# EasyEDA Pro project ProPrj_red-panda-afm_2025-05-21.epro, board PCB2
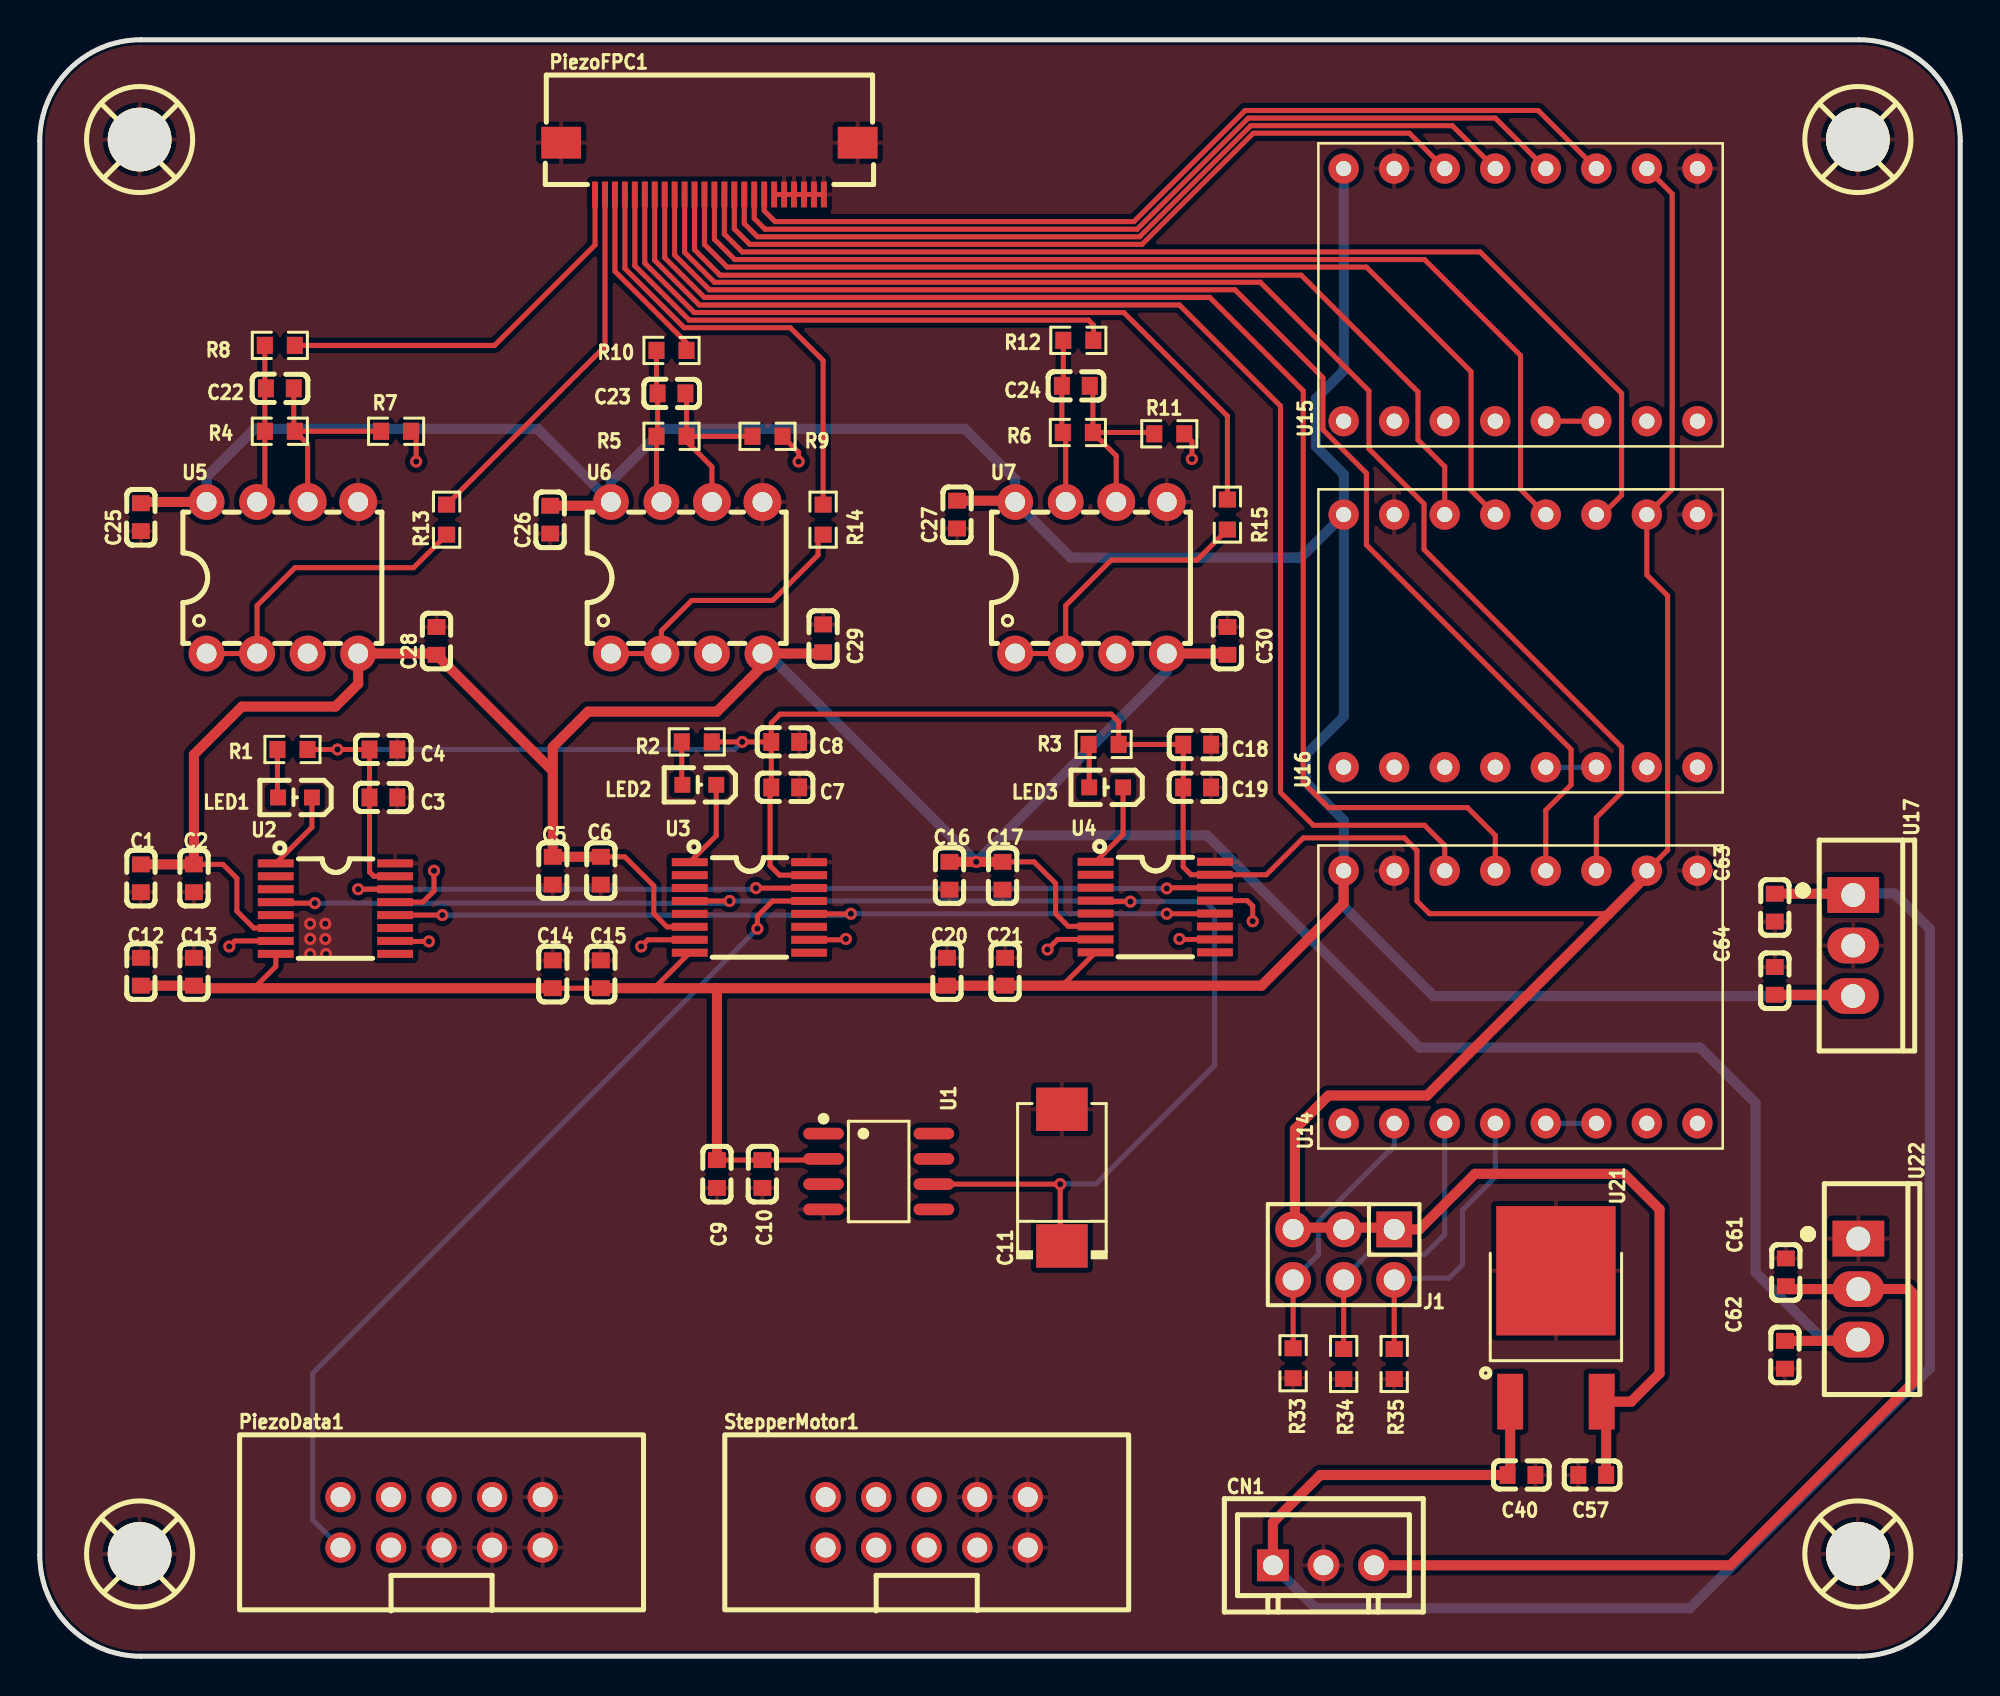
[diagram p8: board, top side]
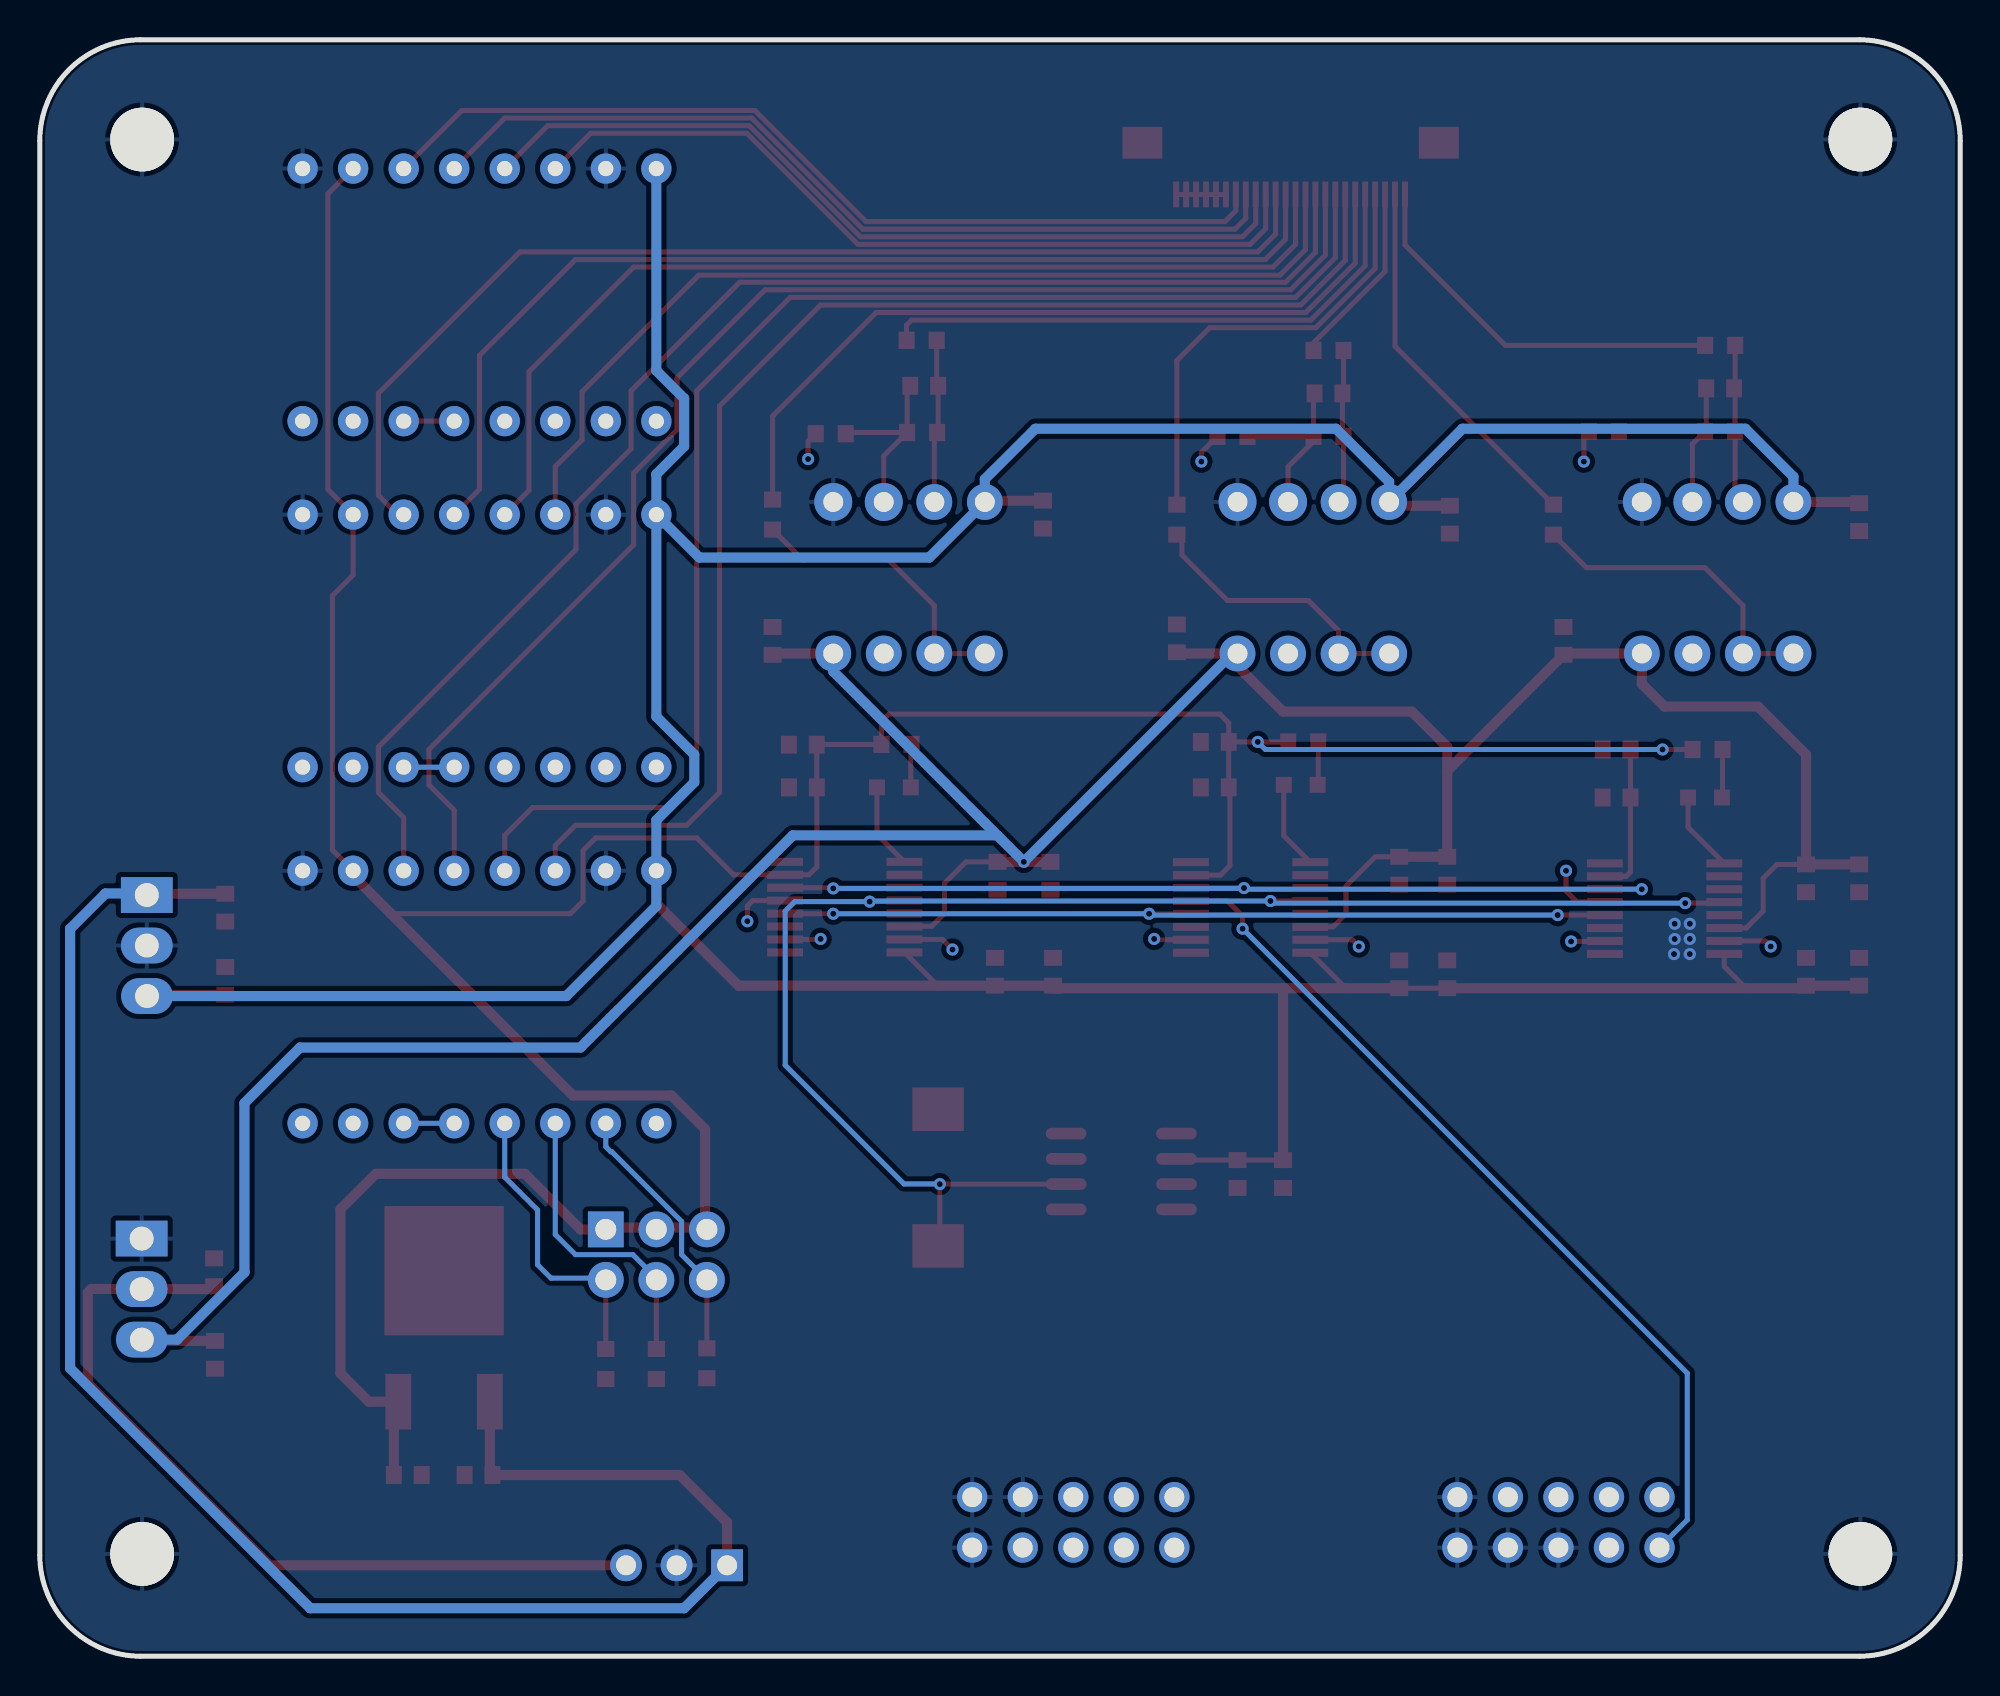
[diagram p9: board, bottom side, seen from below]

Outline 96.52 x 81.28 mm; copper layers: Top Layer, Inner1, Inner2, Bottom Layer. Coordinates in mm from the lower left corner of the outline.
Outline path: 0,76.2 0,5.08 arc(1.49,1.49) 5.08,0 91.44,0 arc(95.03,1.49) 96.52,5.08 96.52,76.2 arc(95.03,79.79) 91.44,81.28 5.08,81.28 arc(1.49,79.79) 0,76.2
Stack: Top Layer 0.035mm Outer layer copper thickness 1oz / Dielectric1 0.2104mm 7628 RC49% 8.6mil / Inner1 0.0152mm Inner layer copper thickness / Dielectric2 1.065mm 1.1mm H/HOZ Copper / Inner2 0.0152mm Inner layer copper thickness / Dielectric3 0.2104mm 7628 RC49% 8.6mil / Bottom Layer 0.035mm Outer layer copper thickness 1oz

## Design rules (mm)
template: JLCPCB Capability(Two Layers Board)
spacing copperThickness1oz (default): track to track 0.102, other pairs 0.152 to 0.3
spacing copperThickness2oz: track to track 0.203, other pairs 0.152 to 0.3
track width copperThickness1oz (default): min 0.127, default 0.254, max 2.54
track width copperThickness2oz: min 0.203, default 0.254, max 2.54
differential pair differentialPair (default): width min 0.127, default 0.254, max 2.54; gap min 0.152, default 0.152
via viaSize (default): diameter min 0.5, default 0.61, max 10; hole min 0.3, default 0.305, max 6.3

## Placement (name value [footprint] x y rotation side)
C1  10uF  [C0603]  5.08 39.12 270 top
C2  100nF  [C0603]  7.75 39.12 270 top
C3  10uF  [C0603]  17.27 43.18 0 top
C4  100nF  [C0603]  17.27 45.59 0 top
C5  10uF  [C0603]  25.78 39.5 270 top
C6  100nF  [C0603]  28.19 39.5 270 top
C7  10uF  [C0603]  37.47 43.69 0 top
C8  100nF  [C0603]  37.47 45.97 0 top
C9  10uF  [C0603]  34.03 24.25 90 top
C10  100nF  [C0603]  36.32 24.25 90 top
C11  100uF  [CAP-SMD_L7.3-W4.3-FD]  51.37 24.07 90 top
C12  10uF  [C0603]  5.08 34.42 270 top
C13  100nF  [C0603]  7.75 34.42 270 top
C14  10uF  [C0603]  25.78 34.29 270 top
C15  100nF  [C0603]  28.19 34.29 270 top
C16  10uF  [C0603]  45.72 39.24 270 top
C17  100nF  [C0603]  48.39 39.24 270 top
C18  10uF  [C0603]  58.17 45.84 0 top
C19  100nF  [C0603]  58.17 43.69 0 top
C20  10uF  [C0603]  45.59 34.42 270 top
C21  100nF  [C0603]  48.51 34.42 270 top
C22  4.7nF  [C0603]  12.06 63.75 180 top
C23  4.7nF  [C0603]  31.75 63.5 180 top
C24  4.7nF  [C0603]  52.07 63.88 180 top
C25  100nF  [C0603]  5.08 57.28 90 top
C26  100nF  [C0603]  25.65 57.15 90 top
C27  100nF  [C0603]  46.1 57.4 90 top
C28  100nF  [C0603]  19.94 51.05 90 top
C29  100nF  [C0603]  39.37 51.18 90 top
C30  100nF  [C0603]  59.69 51.05 90 top
C40  4.7uF  [C0603]  74.47 9.11 0 top
C57  1uF  [C0603]  78.03 9.11 0 top
C61  2.2uF  [C0603]  87.76 19.3 90 top
C62  1uF  [C0603]  87.71 15.16 90 top
C63  0.33uF  [C0603]  87.2 37.64 270 top
C64  100nF  [C0603]  87.2 33.96 270 top
CN1  ZX-XH2.54-3PZZ  [CONN-TH_3P-P2.54_2501S-3P]  64.52 4.57 0 top
J1  2.54-2*3P针  [HDR-TH_6P-P2.54-V-M-R2-C3-S2.54-1]  65.53 20.19 180 top
LED1  -  [LED0603-R-RD]  12.83 43.18 180 top
LED2  -  [LED0603-R-RD]  33.15 43.81 180 top
LED3  -  [LED0603-R-RD]  53.59 43.69 180 top
PiezoData1  2.54-2*5P简牛  [IDC-TH_10P-P2.54_C5665]  20.19 6.73 0 top
PiezoFPC1  AFC01-S24FCA-00  [FPC-SMD_P0.50-24P_FGS-XJ-H2.0]  33.66 74.8 0 top
R1  10k  [R0603]  12.7 45.59 180 top
R2  10k  [R0603]  33.02 45.97 180 top
R3  10k  [R0603]  53.47 45.85 180 top
R4  3k  [R0603]  12.06 61.59 180 top
R5  3k  [R0603]  31.75 61.34 180 top
R6  3k  [R0603]  52.17 61.53 180 top
R7  3k  [R0603]  17.91 61.59 180 top
R8  220  [R0603]  12.06 65.91 0 top
R9  3k  [R0603]  36.58 61.34 180 top
R10  220  [R0603]  31.75 65.66 0 top
R11  3k  [R0603]  56.77 61.47 180 top
R12  220  [R0603]  52.2 66.17 0 top
R13  220  [R0603]  20.45 57.15 90 top
R14  220  [R0603]  39.37 57.15 90 top
R15  220  [R0603]  59.69 57.4 90 top
R33  10K  [R0603]  62.99 14.73 90 top
R34  10K  [R0603]  65.53 14.69 90 top
R35  10K  [R0603]  68.07 14.69 90 top
SCREW1  -  [Screw-Hole-M3]  5.08 76.2 0 top
SCREW2  -  [Screw-Hole-M3]  5.08 5.08 0 top
SCREW3  -  [Screw-Hole-M3]  91.44 5.08 0 top
SCREW4  -  [Screw-Hole-M3]  91.44 76.2 0 top
StepperMotor1  2.54-2*5P简牛  [IDC-TH_10P-P2.54_C5665]  44.58 6.73 0 top
U1  ADR421BRZ-REEL  [SOIC-8_L4.9-W3.9-P1.27-LS6.0-BL]  42.16 24.37 270 top
U2  AD5761RBRUZ  [TSSOP-16_L5.0-W4.4-P0.65-LS6.4-TL]  14.86 37.59 0 top
U3  AD5761RBRUZ  [TSSOP-16_L5.0-W4.4-P0.65-LS6.4-TL]  35.67 37.65 0 top
U4  -  [TSSOP-16_L5.0-W4.4-P0.65-LS6.4-TL]  56.06 37.67 0 top
U5  OPA2227P  [PDIP-8_L9.6-W6.4-P2.54-LS7.6-BL]  12.19 54.23 0 top
U6  OPA2227P  [PDIP-8_L9.6-W6.4-P2.54-LS7.6-BL]  32.51 54.23 0 top
U7  OPA2227P  [PDIP-8_L9.6-W6.4-P2.54-LS7.6-BL]  52.83 54.23 0 top
U14  A4988 Stepper Motor Driver Carrier  [A4988 STEPPER MOTOR DRIVER CARRIER]  74.42 33.15 90 top
U15  A4988 Stepper Motor Driver Carrier  [A4988 STEPPER MOTOR DRIVER CARRIER]  74.42 68.45 90 top
U16  A4988 Stepper Motor Driver Carrier  [A4988 STEPPER MOTOR DRIVER CARRIER]  74.42 51.05 90 top
U17  SL7815  [TO-220-3_L10.0-W4.5-P2.54-L]  91.14 35.74 270 top
U21  BD733L5FP-CE2  [TO-252-3L_L6.6-W6.1-P4.60-LS9.5-BR-CW]  76.2 16.09 270 top
U22  L7915CV  [TO-220-3_L10.0-W4.5-P2.54-L]  91.4 18.46 270 top

## Footprints (pads in the part's own frame, mm; a bottom-side part is the same pattern mirrored in y, then rotated)
A4988 STEPPER MOTOR DRIVER CARRIER
  round 1.524 hole 0.762: 1(-6.35,8.89) 2(-6.35,6.35) 3(-6.35,3.81) 4(-6.35,1.27) 5(-6.35,-1.27) 6(-6.35,-3.81) 7(-6.35,-6.35) 8(-6.35,-8.89) 9(6.35,-8.89) 10(6.35,-6.35) 11(6.35,-3.81) 12(6.35,-1.27) 13(6.35,1.27) 14(6.35,3.81) 15(6.35,6.35) 16(6.35,8.89)
C0603
  rect 0.8x0.9 smd: 1(-0.7,0) 2(0.7,0)
CAP-SMD_L7.3-W4.3-FD
  rect 2.185x2.592 smd: 1(-3.437,0) 2(3.437,0)
CONN-TH_3P-P2.54_2501S-3P
  rect 1.6x1.6 hole 1: 1(-2.54,0)
  round 1.6 hole 1: 2(0,0) 3(2.54,0)
FPC-SMD_P0.50-24P_FGS-XJ-H2.0
  rect 0.3x1.3 smd: 1(-5.748,-1.3) 2(-5.248,-1.3) 3(-4.748,-1.3) 4(-4.248,-1.3) 5(-3.748,-1.3) 6(-3.248,-1.3) 7(-2.748,-1.3) 8(-2.248,-1.3) 9(-1.748,-1.3) 10(-1.248,-1.3) 11(-0.748,-1.3) 12(-0.248,-1.3) 13(0.252,-1.3) 14(0.752,-1.3) 15(1.252,-1.3) 16(1.752,-1.3) 17(2.252,-1.3) 18(2.752,-1.3) 19(3.252,-1.3) 20(3.752,-1.3) 21(4.252,-1.3) 22(4.752,-1.3) 23(5.252,-1.3) 24(5.752,-1.3)
  rect 2x1.6 smd: 25(7.45,1.3) 26(-7.45,1.3)
HDR-TH_6P-P2.54-V-M-R2-C3-S2.54-1
  rect 1.8x1.8 hole 1.05: 1(-2.54,-1.27)
  round 1.8 hole 1.05: 2(-2.54,1.27) 3(0,-1.27) 4(0,1.27) 5(2.54,-1.27) 6(2.54,1.27)
IDC-TH_10P-P2.54_C5665
  round 1.524 hole 1: 1(-5.08,-1.27) 2(-5.08,1.27) 3(-2.54,-1.27) 4(-2.54,1.27) 5(0,-1.27) 6(0,1.27) 7(2.54,-1.27) 8(2.54,1.27) 9(5.08,-1.27) 10(5.08,1.27)
LED0603-R-RD
  rect 0.8x0.8 smd: 1(0.851,0) 2(-0.851,0)
PDIP-8_L9.6-W6.4-P2.54-LS7.6-BL
  round 1.8 hole 1: 1(-3.81,-3.81) 2(-1.27,-3.81) 3(1.27,-3.81) 4(3.81,-3.81) 7(-1.27,3.81) 8(-3.81,3.81)
  round 1.905 hole 1: 5(3.81,3.81) 6(1.27,3.81)
R0603
  rect 0.807x0.864 smd: 1(-0.754,0) 2(0.754,0)
Screw-Hole-M3
  round 3.2 hole 3.2: 1(-0.064,0.064)
SOIC-8_L4.9-W3.9-P1.27-LS6.0-BL
  oval 0.59x2.045 smd: 1(-1.905,-2.771) 2(-0.635,-2.771) 3(0.635,-2.771) 4(1.905,-2.771) 5(1.905,2.773) 6(0.635,2.773) 7(-0.635,2.773) 8(-1.905,2.773)
TO-220-3_L10.0-W4.5-P2.54-L
  rect 1.8x2.6 hole 1.2: 1(-2.54,0.005)
  oval 1.8x2.6 hole 1.2: 2(0,0.005) 3(2.54,-0.005)
TO-252-3L_L6.6-W6.1-P4.60-LS9.5-BR-CW
  rect 2.8x1.3 smd: 1(3.292,-2.3) 3(3.292,2.3)
  rect 6.5x6 smd: 2(-3.292,0)
TSSOP-16_L5.0-W4.4-P0.65-LS6.4-TL
  rect 1.804x0.406 smd: 1(-2.999,2.276) 2(-2.999,1.625) 3(-2.999,0.976) 4(-2.999,0.325) 5(-2.999,-0.325) 6(-2.999,-0.976) 7(-2.999,-1.625) 8(-2.999,-2.276) 9(2.999,-2.276) 10(2.999,-1.625) 11(2.999,-0.976) 12(2.999,-0.325) 13(2.999,0.325) 14(2.999,0.976) 15(2.999,1.625) 16(2.999,2.276)

## Nets
As in the schematic.

Pads without a net: U1 1 3 5 7 8; U2 2 3 9 11; U3 2 3 9 11; U4 2 3 9 11; U14 1; U15 1; U16 1

## Via types
v1: diameter 0.61, hole 0.305, Top Layer to Bottom Layer, 31 vias

## Routing (per net, layer and track width the routed paths; a pad name or vN(x,y) marks a point on that pad's centre or on a via; arc(x,y) is an arc through that point)
3.3V: length 198.5
  Top Layer w0.254: 36.76,45.97 36.76,46.92 37.21,47.37 53.85,47.37 54.22,47 R3.1 57.46,45.85 C18.1 57.47,43.69 C19.1 57.47,39.69 57.86,39.29 U4.15 61.65,39.29 63.5,41.15 68.58,41.15 69.22,40.51 69.22,37.97 69.85,37.34 78.87,37.34 ; 36.76,45.97 36.76,43.69 36.7,43.63 36.7,39.75 37.18,39.28 U3.15 ; 36.76,45.97 v1(35.3,45.97) R2.1 ; J1.5 63.08,21.55 ; R1.1 v1(14.96,45.59) C4.1 C3.1 16.57,39.44 16.79,39.22 U2.15 ; U15.10 82.04,73.53 82.04,58.67 U16.10 80.77,54.37 81.81,53.33 81.81,40.54 U14.10
  Top Layer w0.508: 68.07,21.55 63.08,21.55 63.08,26.51 64.77,28.19 69.72,28.19 80.77,39.24 U14.10 ; J1.1 69.34,21.46 72.14,24.26 79.63,24.26 81.41,22.48 81.41,14.22 79.98,12.8 U21.3 78.73,12.57 C57.2
  Bottom Layer w0.254: v1(14.96,45.59) 34.92,45.59 v1(35.3,45.97)
+15V: length 232.9
  Top Layer w0.254: C14.2 C15.2 ; 51.39,33.72 U4.8 ; U2.8 11.86,34.68 10.77,33.59 ; U1.2 39.33,24.95 C10.2 C9.2 ; 30.88,33.59 U3.8
  Top Layer w0.508: C26.2 28.51,57.85 U6.8 ; C13.2 C12.2 ; 34.02,33.59 C15.2 ; 34.02,33.59 34.03,33.58 C9.2 ; 34.02,33.59 45.47,33.59 C20.2 C21.2 61.4,33.72 65.53,37.85 U14.16 ; U5.8 5.14,58.04 C25.2 ; U17.3 91.07,33.26 C64.2 ; 7.75,33.59 C14.2 ; C27.2 48.96,58.1 U7.8
  Bottom Layer w0.508: U17.3 70.06,33.2 65.53,37.72 U14.16 65.53,42.04 63.63,43.94 63.63,45.34 65.53,47.24 U16.16 ; U5.8 8.38,59.31 10.8,61.72 25.02,61.72 U6.8 28.7,59.06 31.37,61.72 46.48,61.72 49.02,59.18 U7.8 51.82,55.25 63.37,55.25 U16.16 ; U15.16 65.53,64.64 64.13,63.25 64.13,60.83 65.53,59.44 U16.16
-15V: length 173.1
  Top Layer w0.254: U2.6 10.75,36.62 9.91,37.47 9.91,39.12 9.21,39.82 C2.1 ; U4.6 53.05,36.7 51.69,36.7 51.05,37.34 51.05,38.86 49.97,39.94 C17.1 ; U3.6 31.52,36.67 30.86,37.34 30.86,38.73 29.4,40.2 C6.1
  Top Layer w0.508: C30.1 59.62,50.42 U7.4 ; C29.1 39.31,50.42 U6.4 36.32,49.78 34.04,47.5 27.56,47.5 25.78,45.72 25.78,44.51 ; 25.78,44.51 C5.1 C6.1 ; 25.78,44.51 C28.1 19.87,50.42 U5.4 16,48.89 14.86,47.75 10.16,47.75 7.75,45.34 C2.1 C1.1 ; C16.1 v1(47.06,39.94) C17.1 ; U22.3 91.33,15.86 C62.2
  Bottom Layer w0.508: 48.4,41.28 v1(47.06,39.94) 36.59,50.42 U6.4 ; 48.4,41.28 56.64,49.52 U7.4 ; 48.4,41.28 58.67,41.28 69.34,30.61 83.44,30.61 86.23,27.81 86.23,19.3 89.62,15.92 U22.3
GND: length 2.5
  Top Layer w0.254: PiezoFPC1.24 PiezoFPC1.23 PiezoFPC1.22 PiezoFPC1.21 PiezoFPC1.20 PiezoFPC1.19
  vias: v1(13.59,36.83) v1(13.59,36.07) v1(13.59,35.31) v1(14.35,36.83) v1(14.35,36.06) v1(14.38,35.31)
1A0: length 68.7
  Top Layer w0.254: PiezoFPC1.9 31.91,70.45 33.66,68.71 60.07,68.71 64.49,64.29 64.49,61.67 66.68,59.49 66.68,55.88 76.96,45.59 76.96,43.81 75.69,42.55 U14.12
1A1: length 53.7
  Top Layer w0.254: U16.12 74.42,58.67 74.42,65.41 69.6,70.23 34.93,70.23 33.91,71.25 PiezoFPC1.13
1A2: length 44.6
  Top Layer w0.254: PiezoFPC1.17 35.91,72.3 36.45,71.75 55.15,71.75 60.74,77.34 73.15,77.34 U15.12
1B0: length 70.1
  Top Layer w0.254: U14.11 78.23,42.16 79.5,43.43 79.5,45.72 69.57,55.65 69.57,57.94 66.8,60.71 66.8,63.63 61.34,69.09 33.91,69.09 32.41,70.59 PiezoFPC1.10
1B1: length 57.2
  Top Layer w0.254: PiezoFPC1.14 34.41,71.51 35.31,70.61 72.39,70.61 79.5,63.5 79.5,58.37 78.53,57.4 U16.11
1B2: length 46.4
  Top Layer w0.254: U15.11 75.31,77.72 60.58,77.72 54.99,72.14 36.96,72.14 36.41,72.69 PiezoFPC1.18
2A0: length 70.3
  Top Layer w0.254: U14.13 73.15,41.28 71.75,42.67 64.77,42.67 63.5,43.94 63.5,63.63 58.8,68.33 33.4,68.33 31.41,70.32 PiezoFPC1.8
2A1: length 51.4
  Top Layer w0.254: U16.13 71.93,58.62 71.93,64.59 66.68,69.85 34.54,69.85 33.41,70.99 PiezoFPC1.12
2A2: length 42.7
  Top Layer w0.254: PiezoFPC1.16 35.41,72.03 36.07,71.37 55.28,71.37 60.86,76.96 70.99,76.96 U15.13
2B0: length 67.9
  Top Layer w0.254: PiezoFPC1.7 30.91,70.19 33.15,67.95 57.28,67.95 62.36,62.86 62.36,43.43 64.01,41.78 69.6,41.78 70.61,40.77 U14.14
2B1: length 48.8
  Top Layer w0.254: PiezoFPC1.11 32.91,70.72 34.19,69.44 63.4,69.44 69.27,63.57 69.27,61.16 70.61,59.82 U16.14
2B2: length 40.8
  Top Layer w0.254: U15.14 68.83,76.58 60.99,76.58 55.4,70.99 35.69,70.99 34.91,71.77 PiezoFPC1.15
-X: length 19.7
  Top Layer w0.254: PiezoFPC1.1 27.91,70.96 22.86,65.91 R8.2
-Y: length 9
  Top Layer w0.254: 32.5,66.04 28.91,69.64 PiezoFPC1.3
-Z: length 28.6
  Top Layer w0.254: R12.2 52.96,66.17 52.96,66.93 52.71,67.18 32.64,67.18 29.91,69.92 PiezoFPC1.5
CS0: length 35.9
  Top Layer w0.254: U2.13 19.25,37.92 19.81,38.48 v1(19.81,39.5)
  Inner1 w0.254: PiezoData1.8 22.73,36.58 v1(19.81,39.5)
CS1: length 44.5
  Top Layer w0.254: v1(36.07,36.58) 36.07,37.21 36.83,37.97 38.66,37.97 U3.13
  Bottom Layer w0.254: PiezoData1.1 13.72,6.86 13.72,14.23 v1(36.07,36.58)
CS2: length 61.4
  Top Layer w0.254: v1(60.96,36.96) 60.96,37.72 60.69,37.99 U4.13
  Inner1 w0.254: PiezoData1.3 19.56,3.56 28.83,3.56 60.96,35.69 v1(60.96,36.96)
DIR0: length 52.4
  Inner2 w0.254: StepperMotor1.3 44.83,2.67 54.86,2.67 63.5,11.3 67.82,11.3 83.31,26.8
DIR1: length 67.8
  Inner2 w0.254: U16.8 80.52,41.91 65.28,41.91 64.39,41.02 64.39,27.43 60.07,23.11 60.07,13.21 50.42,3.56 49.02,3.56 StepperMotor1.7
DIR2: length 81.2
  Inner2 w0.254: StepperMotor1.4 62.74,28.7 62.74,57.91 64.39,59.56 81.53,59.56 83.31,61.34 U15.8
MS1: length 50.5
  Top Layer w0.254: J1.6 R33.2
  Inner1 w0.254: 68.07,26.8 68.07,38.03 69.11,39.07 69.11,40.23 68.07,41.28 68.07,55.81 69.11,56.85 69.11,58.14 68.07,59.18 U15.2
  Bottom Layer w0.254: J1.6 64.26,20.19 64.26,21.86 67.77,25.36 67.82,25.36 68.07,25.62 68.07,26.8
MS2: length 52.2
  Top Layer w0.254: R34.2 65.53,19.01
  Inner1 w0.254: 70.61,26.8 70.61,38.03 71.65,39.07 71.65,39.93 70.61,40.97 70.61,55.81 71.65,56.85 71.65,58.14 70.61,59.18 U15.3
  Bottom Layer w0.254: 65.53,19.01 66.71,20.19 69.6,20.19 70.61,21.21 70.61,26.8
MS3: length 52.1
  Top Layer w0.254: R35.2 68.07,19.01
  Inner1 w0.254: 73.15,26.8 73.15,38.03 72.11,39.07 72.11,39.93 73.15,40.97 73.15,55.81 72.11,56.85 72.11,58.01 73.15,59.06 U15.4
  Bottom Layer w0.254: 68.07,19.01 70.83,19.01 71.5,19.69 71.5,22.44 73.15,24.09 73.15,26.8
SCLK: length 78.7
  Top Layer w0.254: U2.14 v1(16,38.57) ; v1(36,38.63) U3.14 ; v1(56.64,38.61) 56.68,38.64 U4.14
  Inner1 w0.254: PiezoData1.2 14.99,8.13 14.99,14.61 16,15.62 v1(16,38.57)
  Bottom Layer w0.254: v1(16,38.57) 35.94,38.57 v1(36,38.63) 36.01,38.61 v1(56.64,38.61)
SDI: length 72.6
  Top Layer w0.254: v1(56.64,37.33) 59.05,37.33 U4.12 ; v1(40.77,37.33) 40.76,37.33 38.67,37.33 ; v1(20.23,37.27) U2.12
  Inner1 w0.254: PiezoData1.6 20.23,8.04 v1(20.23,37.27)
  Bottom Layer w0.254: v1(56.64,37.33) v1(40.77,37.33) 40.7,37.27 v1(20.23,37.27)
SDO: length 76
  Top Layer w0.254: U4.10 57.3,36.04 v1(57.28,36.07) ; v1(40.51,36.07) 40.47,36.03 U3.10 ; v1(19.56,35.94) 17.88,35.94 U2.10
  Inner2 w0.254: 38.74,33.53 20.7,33.53 ; 38.74,33.53 40.51,35.31 v1(40.51,36.07) ; 38.74,33.53 54.74,33.53 v1(57.28,36.07) ; 20.7,33.53 19.56,34.67 v1(19.56,35.94) ; 20.7,33.53 20.7,13.97 17.65,10.92 PiezoData1.4
SLP: length 86.1
  Top Layer w0.254: U15.5 U15.6
  Inner1 w0.254: StepperMotor1.6 61.21,24.64 76.07,24.64 78.23,26.8 78.23,38.03 79.27,39.07 79.27,39.93 78.23,40.97 U16.6 78.23,55.93 77.19,56.97 77.19,57.84 78.23,58.88 U15.6
  Bottom Layer w0.254: 75.69,26.8 78.23,26.8 ; U16.5 U16.6
STEP0: length 65.5
  Inner2 w0.254: StepperMotor1.1 43.43,1.52 55.37,1.52 64.52,10.67 70.49,10.67 85.47,25.65 85.47,27.56 84.33,28.7 82.68,28.7 80.77,26.8
STEP1: length 65
  Inner2 w0.254: U16.7 78.99,42.93 65.41,42.93 63.5,41.02 63.5,28.07 58.93,23.5 58.93,14.99 50.67,6.73 45.85,6.73 StepperMotor1.5
STEP2: length 80.1
  Inner2 w0.254: StepperMotor1.2 61.98,30.48 61.98,58.55 63.88,60.45 79.12,60.45 U15.7
V++: length 88.3
  Top Layer w0.508: CN1.1 61.98,6.73 64.36,9.11 C40.1 73.9,9.24 U21.1 ; C63.1 91.08,38.34 U17.1
  Bottom Layer w0.508: U17.1 91.22,38.35 93.22,38.35 95,36.58 95,14.48 82.93,2.41 64.13,2.41 CN1.1
V--: length 41.9
  Top Layer w0.508: C61.1 87.9,18.46 U22.2 91.41,18.47 93.93,18.47 94.11,18.29 94.11,13.72 84.96,4.57 CN1.3
VREF1: length 78.7
  Top Layer w0.254: C11.1 51.29,20.72 v1(51.29,23.74) 44.94,23.74 ; U4.4 53.11,37.94 v1(54.81,37.94) ; U2.4 11.91,37.87 v1(13.82,37.87) ; U3.4 v1(34.67,37.98)
  Bottom Layer w0.254: v1(13.82,37.87) 34.56,37.87 v1(34.67,37.98) 54.78,37.98 v1(54.81,37.94) 58.58,37.94 59.06,37.47 59.06,29.72 53.09,23.75 51.3,23.75 v1(51.29,23.74)
X: length 18.9
  Top Layer w0.254: PiezoFPC1.2 28.41,65.86 R13.2
XOUT: length 32.4
  Top Layer w0.254: v1(9.53,35.69) 9.8,35.97 U2.7 ; v1(18.92,60.07) 18.92,61.34 R7.1
  Inner1 w0.254: v1(9.53,35.69) 9.53,46.48 U5.3 13.46,52.2 18.92,57.65 v1(18.92,60.07)
Y: length 23
  Top Layer w0.254: PiezoFPC1.4 29.41,69.78 32.38,66.8 37.72,66.8 39.37,65.15 39.37,58.16 39.12,57.9
YOUT: length 31.8
  Top Layer w0.254: v1(38.14,60.07) 38.14,60.53 R9.1 ; U3.7 30.56,36.03 v1(30.23,35.69)
  Inner1 w0.254: v1(30.23,35.69) 30.23,46.86 U6.3 33.78,50.8 38.14,55.16 v1(38.14,60.07)
Z: length 40.1
  Top Layer w0.254: R15.2 59.69,62.36 54.48,67.56 32.89,67.56 30.41,70.05 PiezoFPC1.6
ZOUT: length 31.7
  Top Layer w0.254: v1(57.9,60.2) 57.9,61.09 R11.1 ; v1(50.65,35.53) 51.16,36.04 U4.7
  Inner1 w0.254: v1(57.9,60.2) 57.91,60.19 57.91,54.23 U7.3 50.65,46.96 v1(50.65,35.53)
$1N3650: length 4.4
  Top Layer w0.254: LED2.2 34,41.26 U3.1
$1N3651: length 2.2
  Top Layer w0.254: LED2.1 32.27,43.85 R2.2
$1N3669: length 4.1
  Top Layer w0.254: U2.1 13.68,41.69 LED1.2
$1N3670: length 2.4
  Top Layer w0.254: LED1.1 11.95,43.21 R1.2
$1N3706: length 4.3
  Top Layer w0.254: U4.1 54.44,41.33 LED3.2
$1N3707: length 2.2
  Top Layer w0.254: R3.2 52.74,45.82 LED3.1
$1N3721: length 8
  Top Layer w0.254: R8.1 R4.2 11.31,58.43 U5.7
$1N3722: length 10.3
  Top Layer w0.254: U5.6 13.46,60.95 R4.1 ; R4.1 R7.2 ; R4.1 12.77,61.65 C22.1
$1N3754: length 16
  Top Layer w0.254: U5.1 U5.2 10.92,52.83 12.83,54.74 18.79,54.74 R13.1
$1N16955: length 7.8
  Top Layer w0.254: U6.7 31,58.29 31,61.59 31.05,61.65 31.05,63.75 31,63.81 R10.1
$1N16956: length 9.8
  Top Layer w0.254: 32.5,61.59 32.5,63.7 32.45,63.75 ; 32.5,61.59 32.76,61.34 35.56,61.34 35.82,61.59 ; 32.5,61.59 32.5,61.09 33.78,59.81 U6.6
$1N16967: length 14.2
  Top Layer w0.254: 39.12,56.4 39.12,55.37 36.83,53.09 32.77,53.09 31.24,51.56 U6.2 U6.1
$1N17568: length 8.2
  Top Layer w0.254: R12.1 51.44,63.95 C24.2 51.37,61.58 51.56,61.39 U7.7
$1N17569: length 9.5
  Top Layer w0.254: U7.6 54.1,60.36 R6.1 ; R6.1 52.93,63.72 C24.1 ; R6.1 55.95,61.53 R11.2
$1N17580: length 14.7
  Top Layer w0.254: U7.1 U7.2 51.56,52.83 53.85,55.12 58.16,55.12 R15.1

## Copper pours and planes (outline as drawn; the poured copper is in the pictures)
GND on Top Layer: -9.4,93.85 130.05,93.85 130.05,-13.72 -9.4,-13.72
GND on Bottom Layer: -11.43,97.54 132.46,97.54 132.46,-8.51 -11.43,-8.51
